# Altium schematic sheet [0X] - CPU.SchDoc
size A2; DocumentNumber: 2; SheetNumber: 2; SheetTotal: 4
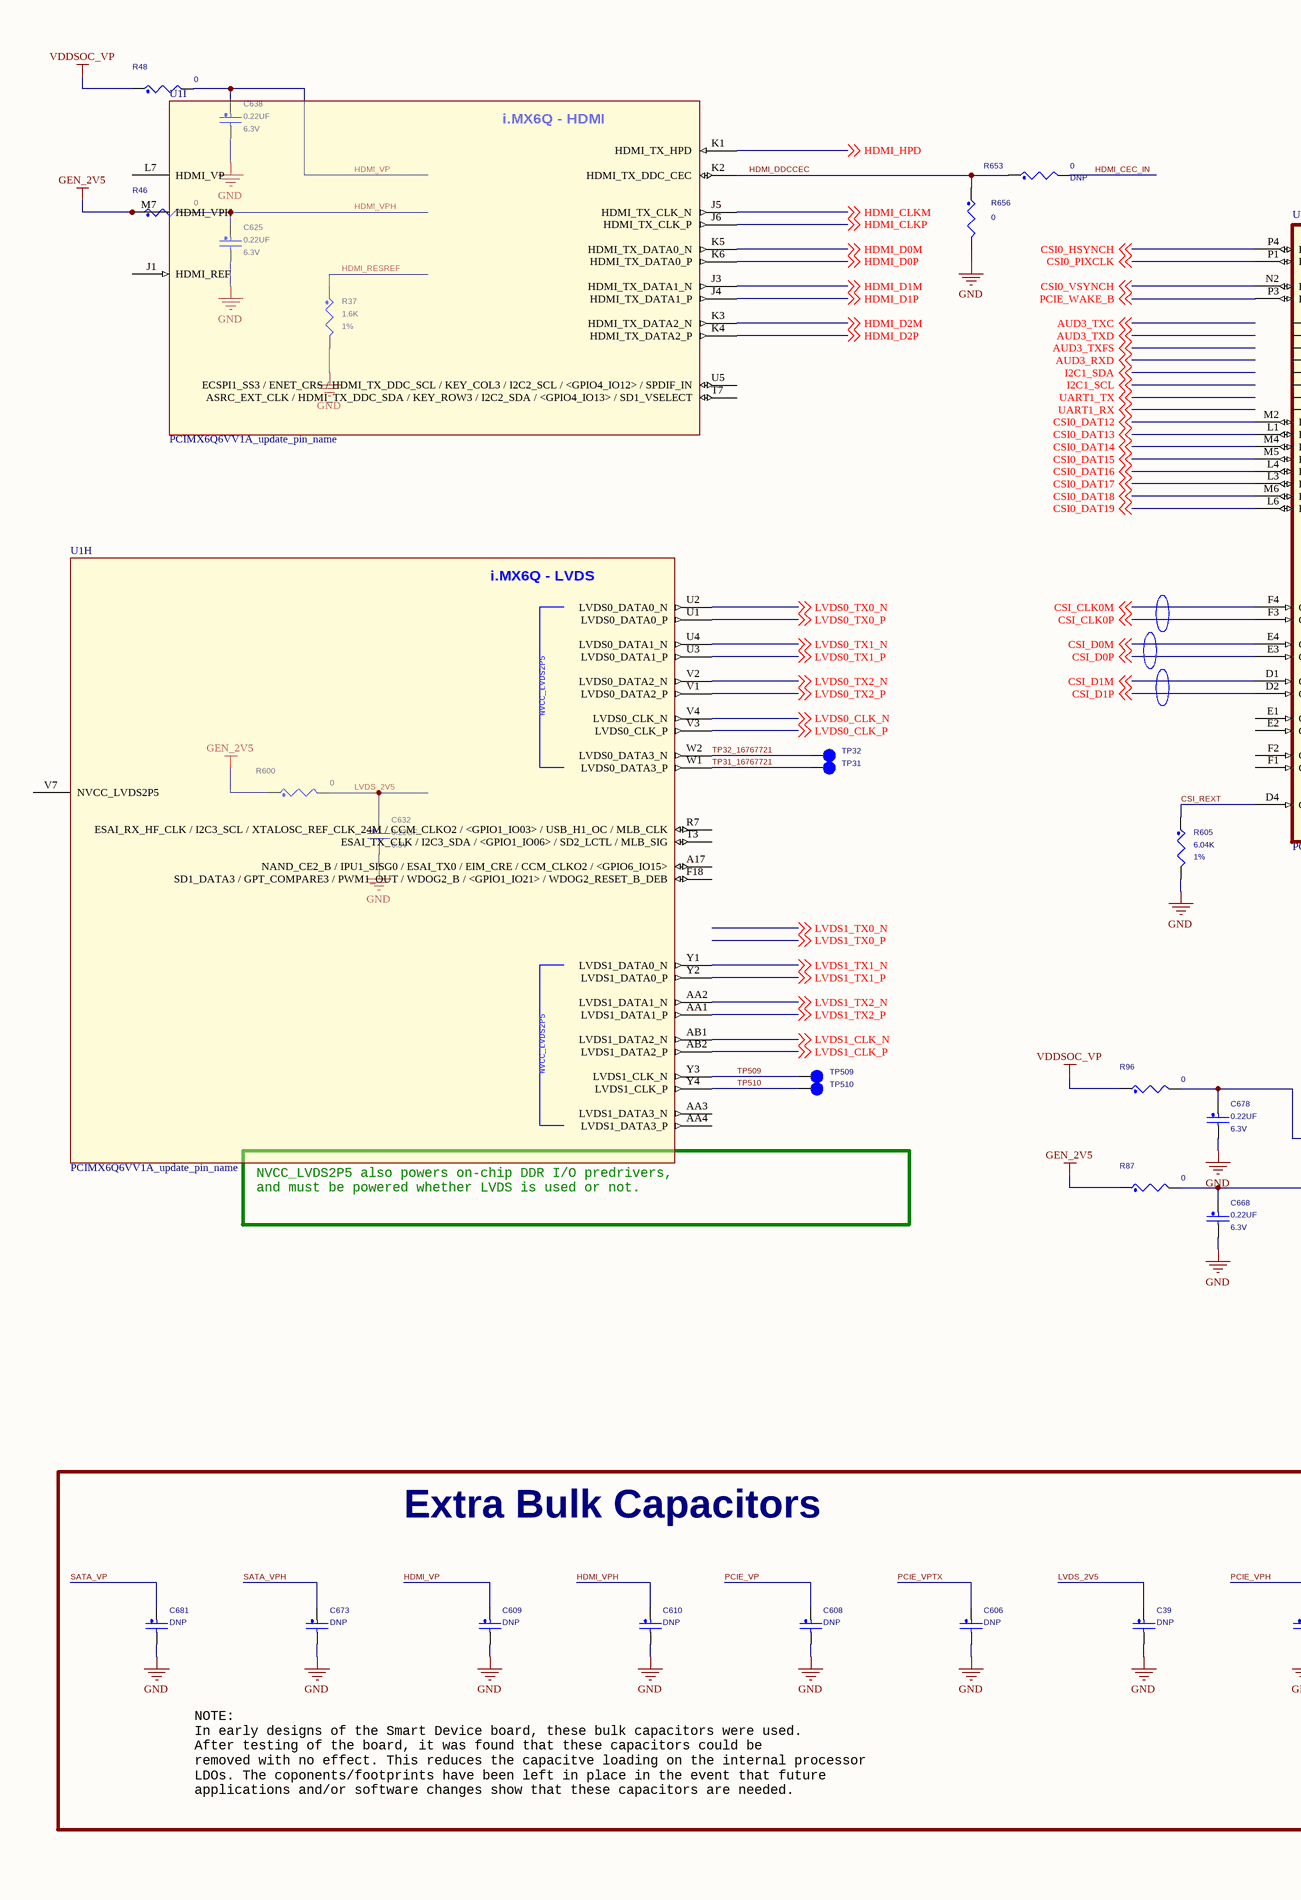
[diagram p0: [0X] - CPU.SchDoc, left]
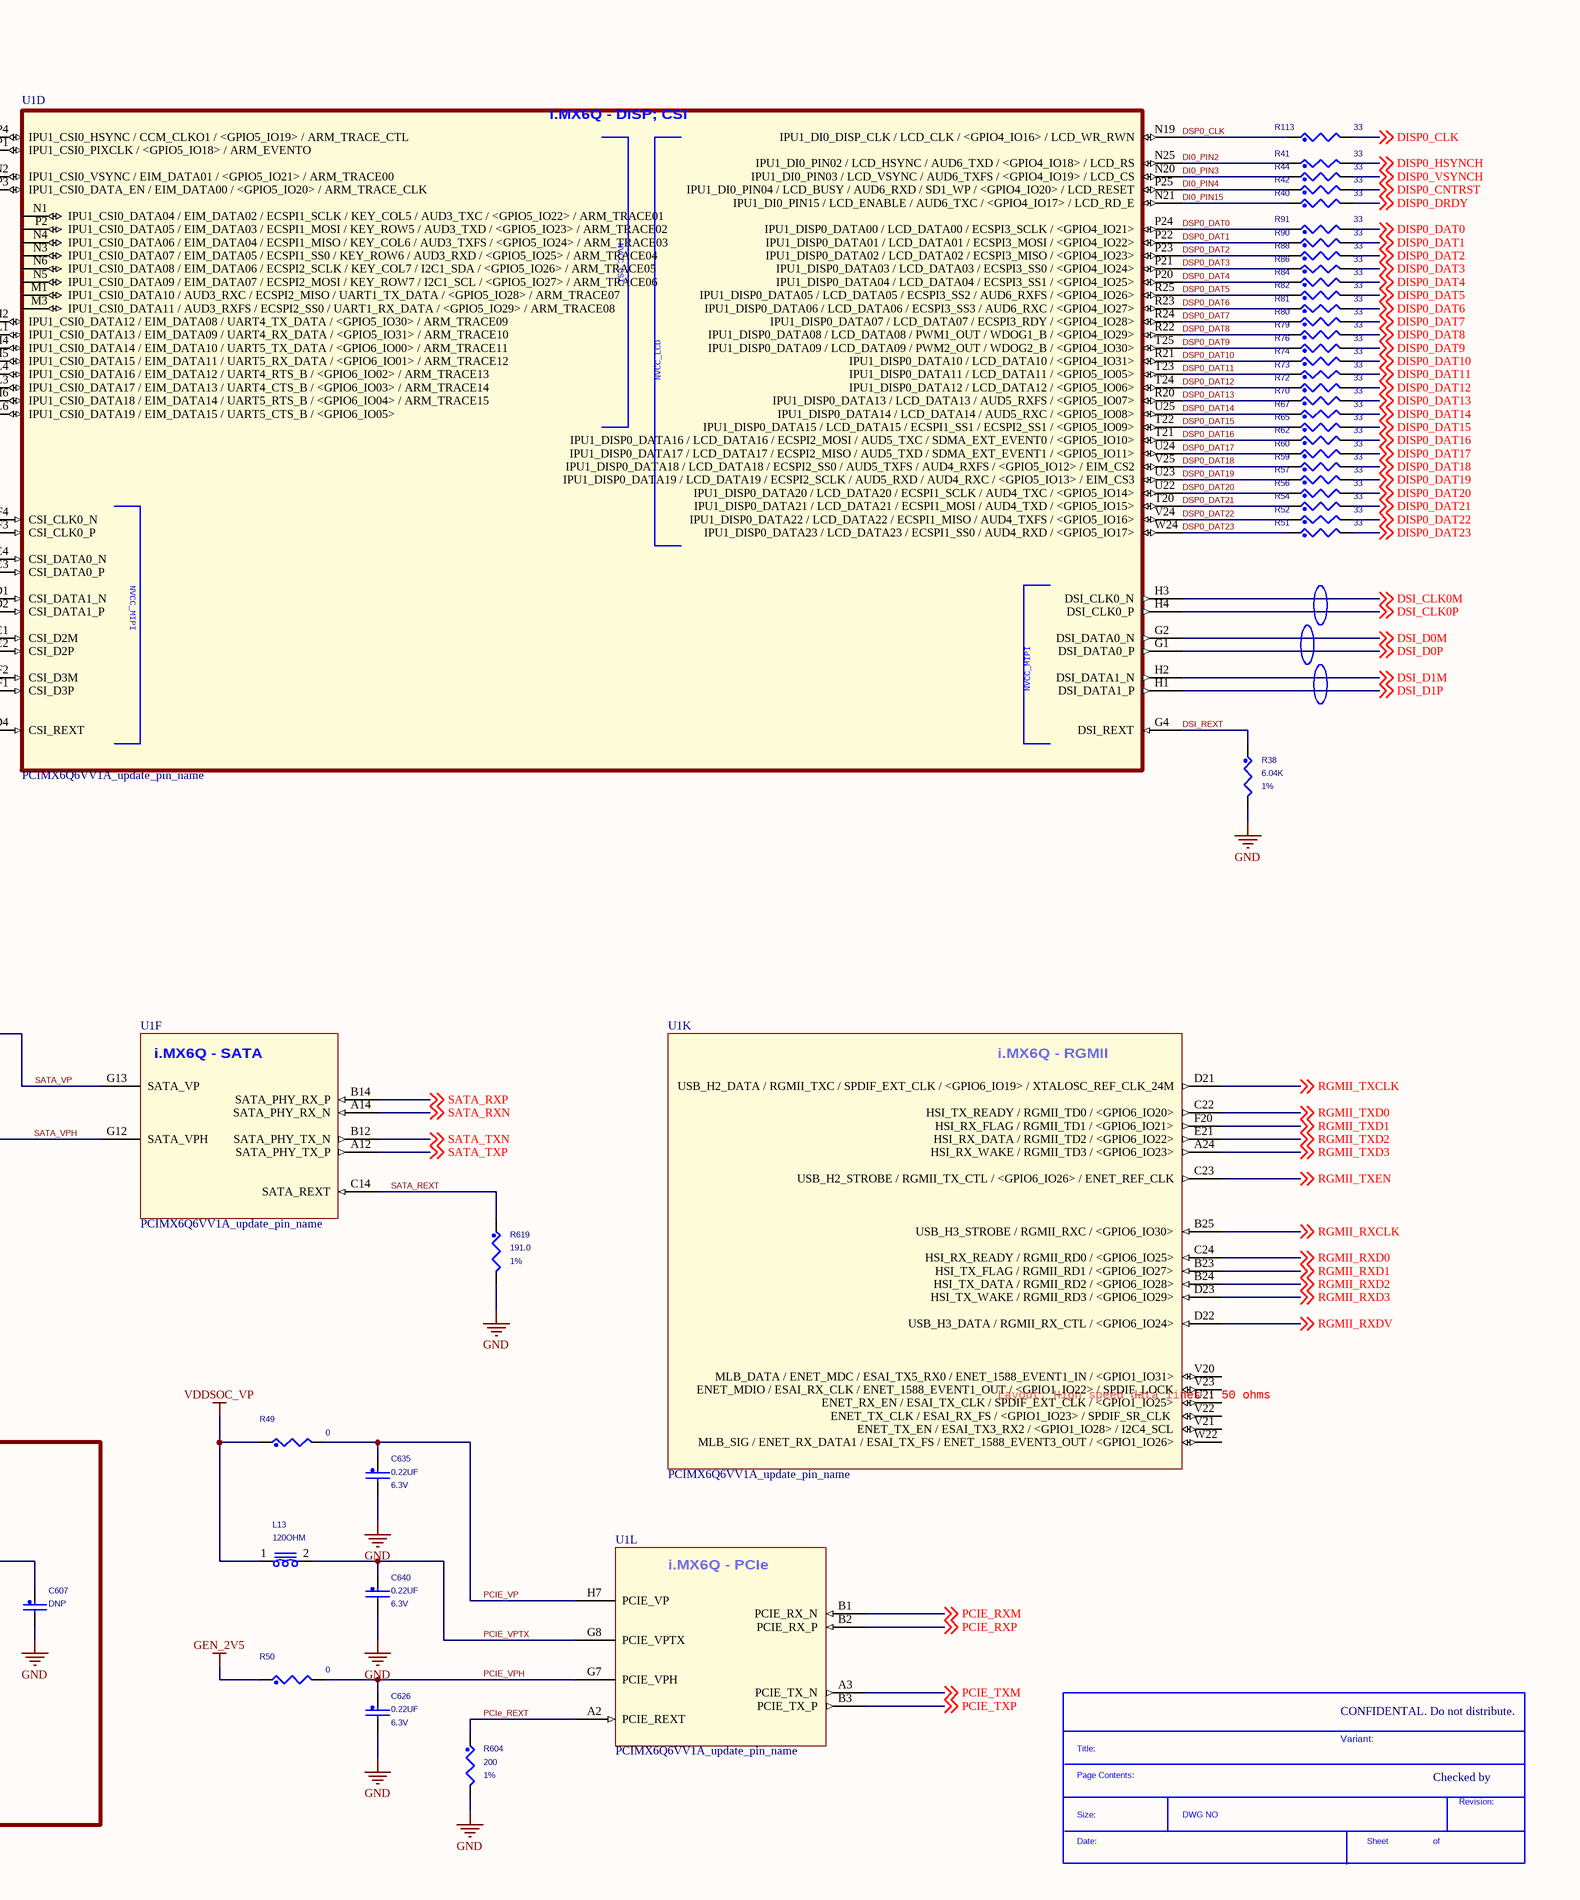
[diagram p1: [0X] - CPU.SchDoc, right]

## Parts
*  SDTitleBlock  (value not drawn)  (graphical)
C39  ASSY_OPT: DNP  [0603_CC]  (hidden comment: 4.7UF)
C606  ASSY_OPT: DNP  [0603_CC]  (hidden comment: 4.7UF)
C607  ASSY_OPT: DNP  [0603_CC]  (hidden comment: 4.7UF)
C608  ASSY_OPT: DNP  [0603_CC]  (hidden comment: 4.7UF)
C609  ASSY_OPT: DNP  [0603_CC]  (hidden comment: 4.7UF)
C610  ASSY_OPT: DNP  [0603_CC]  (hidden comment: 4.7UF)
C625  0.22UF  WVDC: 6.3V  [0201_CC]
C626  0.22UF  WVDC: 6.3V  [0201_CC]
C632  0.22UF  WVDC: 6.3V  [0201_CC]
C635  0.22UF  WVDC: 6.3V  [0201_CC]
C638  0.22UF  WVDC: 6.3V  [0201_CC]
C640  0.22UF  WVDC: 6.3V  [0201_CC]
C668  0.22UF  WVDC: 6.3V  [0201_CC]
C673  ASSY_OPT: DNP  [0603_CC]  (hidden comment: 4.7UF)
C678  0.22UF  WVDC: 6.3V  [0201_CC]
C681  ASSY_OPT: DNP  [0603_CC]  (hidden comment: 4.7UF)
L13  120OHM  [0603_CC]
R37  1.6K  Tolerance: 1%  [0402_CC]
R38  6.04K  Tolerance: 1%  [0402_CC]
R40  33  [0402_CC]
R41  33  [0402_CC]
R42  33  [0402_CC]
R44  33  [0402_CC]
R46  0  [0402_CC]
R48  0  [0402_CC]
R49  0  [0402_CC]
R50  0  [0402_CC]
R51  33  [0402_CC]
R52  33  [0402_CC]
R54  33  [0402_CC]
R56  33  [0402_CC]
R57  33  [0402_CC]
R59  33  [0402_CC]
R60  33  [0402_CC]
R62  33  [0402_CC]
R65  33  [0402_CC]
R67  33  [0402_CC]
R70  33  [0402_CC]
R72  33  [0402_CC]
R73  33  [0402_CC]
R74  33  [0402_CC]
R76  33  [0402_CC]
R79  33  [0402_CC]
R80  33  [0402_CC]
R81  33  [0402_CC]
R82  33  [0402_CC]
R84  33  [0402_CC]
R86  33  [0402_CC]
R87  0  [0402_CC]
R88  33  [0402_CC]
R90  33  [0402_CC]
R91  33  [0402_CC]
R96  0  [0402_CC]
R113  33  [0402_CC]
R600  0  [0402_CC]
R604  200  Tolerance: 1%  [0402_CC]
R605  6.04K  Tolerance: 1%  [0402_CC]
R619  191.0  Tolerance: 1%  [0603_CC]
R653  0  ASSY_OPT: DNP  [0402_CC]
R656  0  [0402_CC]
TP31  tpad_020  [tpad_020]  (value not drawn)
TP32  tpad_020  [tpad_020]  (value not drawn)
TP509  tpad_020  [tpad_020]  (value not drawn)
TP510  tpad_020  [tpad_020]  (value not drawn)
U1  PCIMX6Q6VV1A_update_pin_name  (parts D,F,H,I,K,L of 17)

## Blocks framed on the sheet
Extra Bulk Capacitors: C39 C606-C610 C673 C681

## Nets
GEN_2V5: R46.1 R50.1 R87.1 R600.1 U1.M7(HDMI_VPH)
GND: C39.2 C606.2 C607.2 C608.2 C609.2 C610.2 C625.2 C626.2 C632.2 C635.2 C638.2 C640.2 C668.2 C673.2 C678.2 C681.2 R37.2 R38.2 R604.2 R605.2 R619.2 R656.2
VDDSOC_VP: L13.1 R48.1 R49.1 R96.1
CSI0_DAT12: U1.M2(IPU1_CSI0_DATA12_/_EIM_DATA08_/_UART4_TX_DATA_/_<GPIO5_IO30>_/_ARM_TRACE09) ; off-sheet CSI0_DAT12
CSI0_DAT13: U1.L1(IPU1_CSI0_DATA13_/_EIM_DATA09_/_UART4_RX_DATA_/_<GPIO5_IO31>_/_ARM_TRACE10) ; off-sheet CSI0_DAT13
CSI0_DAT14: U1.M4(IPU1_CSI0_DATA14_/_EIM_DATA10_/_UART5_TX_DATA_/_<GPIO6_IO00>_/_ARM_TRACE11) ; off-sheet CSI0_DAT14
CSI0_DAT15: U1.M5(IPU1_CSI0_DATA15_/_EIM_DATA11_/_UART5_RX_DATA_/_<GPIO6_IO01>_/_ARM_TRACE12) ; off-sheet CSI0_DAT15
CSI0_DAT16: U1.L4(IPU1_CSI0_DATA16_/_EIM_DATA12_/_UART4_RTS_B_/_<GPIO6_IO02>_/_ARM_TRACE13) ; off-sheet CSI0_DAT16
CSI0_DAT17: U1.L3(IPU1_CSI0_DATA17_/_EIM_DATA13_/_UART4_CTS_B_/_<GPIO6_IO03>_/_ARM_TRACE14) ; off-sheet CSI0_DAT17
CSI0_DAT18: U1.M6(IPU1_CSI0_DATA18_/_EIM_DATA14_/_UART5_RTS_B_/_<GPIO6_IO04>_/_ARM_TRACE15) ; off-sheet CSI0_DAT18
CSI0_DAT19: U1.L6(IPU1_CSI0_DATA19_/_EIM_DATA15_/_UART5_CTS_B_/_<GPIO6_IO05>) ; off-sheet CSI0_DAT19
CSI0_HSYNCH: U1.P4(IPU1_CSI0_HSYNC_/_CCM_CLKO1_/_<GPIO5_IO19>_/_ARM_TRACE_CTL) ; off-sheet CSI0_HSYNCH
CSI0_PIXCLK: U1.P1(IPU1_CSI0_PIXCLK_/_<GPIO5_IO18>_/_ARM_EVENTO) ; off-sheet CSI0_PIXCLK
CSI0_VSYNCH: U1.N2(IPU1_CSI0_VSYNC_/_EIM_DATA01_/_<GPIO5_IO21>_/_ARM_TRACE00) ; off-sheet CSI0_VSYNCH
CSI_CLK0M: U1.F4(CSI_CLK0_N) ; off-sheet CSI_CLK0M
CSI_CLK0P: U1.F3(CSI_CLK0_P) ; off-sheet CSI_CLK0P
CSI_D0M: U1.E4(CSI_DATA0_N) ; off-sheet CSI_D0M
CSI_D0P: U1.E3(CSI_DATA0_P) ; off-sheet CSI_D0P
CSI_D1M: U1.D1(CSI_DATA1_N) ; off-sheet CSI_D1M
CSI_D1P: U1.D2(CSI_DATA1_P) ; off-sheet CSI_D1P
CSI_REXT: R605.1 U1.D4(CSI_REXT)
DI0_PIN2: R41.1 U1.N25(IPU1_DI0_PIN02_/_LCD_HSYNC_/_AUD6_TXD_/_<GPIO4_IO18>_/_LCD_RS)
DI0_PIN3: R44.1 U1.N20(IPU1_DI0_PIN03_/_LCD_VSYNC_/_AUD6_TXFS_/_<GPIO4_IO19>_/_LCD_CS)
DI0_PIN4: R42.1 U1.P25(IPU1_DI0_PIN04_/_LCD_BUSY_/_AUD6_RXD_/_SD1_WP_/_<GPIO4_IO20>_/_LCD_RESET)
DI0_PIN15: R40.1 U1.N21(IPU1_DI0_PIN15_/_LCD_ENABLE_/_AUD6_TXC_/_<GPIO4_IO17>_/_LCD_RD_E)
DISP0_CLK: R113.2 ; off-sheet DISP0_CLK
DISP0_CNTRST: R42.2 ; off-sheet DISP0_CNTRST
DISP0_DAT0: R91.2 ; off-sheet DISP0_DAT0
DISP0_DAT1: R90.2 ; off-sheet DISP0_DAT1
DISP0_DAT2: R88.2 ; off-sheet DISP0_DAT2
DISP0_DAT3: R86.2 ; off-sheet DISP0_DAT3
DISP0_DAT4: R84.2 ; off-sheet DISP0_DAT4
DISP0_DAT5: R82.2 ; off-sheet DISP0_DAT5
DISP0_DAT6: R81.2 ; off-sheet DISP0_DAT6
DISP0_DAT7: R80.2 ; off-sheet DISP0_DAT7
DISP0_DAT8: R79.2 ; off-sheet DISP0_DAT8
DISP0_DAT9: R76.2 ; off-sheet DISP0_DAT9
DISP0_DAT10: R74.2 ; off-sheet DISP0_DAT10
DISP0_DAT11: R73.2 ; off-sheet DISP0_DAT11
DISP0_DAT12: R72.2 ; off-sheet DISP0_DAT12
DISP0_DAT13: R70.2 ; off-sheet DISP0_DAT13
DISP0_DAT14: R67.2 ; off-sheet DISP0_DAT14
DISP0_DAT15: R65.2 ; off-sheet DISP0_DAT15
DISP0_DAT16: R62.2 ; off-sheet DISP0_DAT16
DISP0_DAT17: R60.2 ; off-sheet DISP0_DAT17
DISP0_DAT18: R59.2 ; off-sheet DISP0_DAT18
DISP0_DAT19: R57.2 ; off-sheet DISP0_DAT19
DISP0_DAT20: R56.2 ; off-sheet DISP0_DAT20
DISP0_DAT21: R54.2 ; off-sheet DISP0_DAT21
DISP0_DAT22: R52.2 ; off-sheet DISP0_DAT22
DISP0_DAT23: R51.2 ; off-sheet DISP0_DAT23
DISP0_DRDY: R40.2 ; off-sheet DISP0_DRDY
DISP0_HSYNCH: R41.2 ; off-sheet DISP0_HSYNCH
DISP0_VSYNCH: R44.2 ; off-sheet DISP0_VSYNCH
DSI_CLK0M: U1.H3(DSI_CLK0_N) ; off-sheet DSI_CLK0M
DSI_CLK0P: U1.H4(DSI_CLK0_P) ; off-sheet DSI_CLK0P
DSI_D0M: U1.G2(DSI_DATA0_N) ; off-sheet DSI_D0M
DSI_D0P: U1.G1(DSI_DATA0_P) ; off-sheet DSI_D0P
DSI_D1M: U1.H2(DSI_DATA1_N) ; off-sheet DSI_D1M
DSI_D1P: U1.H1(DSI_DATA1_P) ; off-sheet DSI_D1P
DSI_REXT: R38.1 U1.G4(DSI_REXT)
DSP0_CLK: R113.1 U1.N19(IPU1_DI0_DISP_CLK_/_LCD_CLK_/_<GPIO4_IO16>_/_LCD_WR_RWN)
DSP0_DAT0: R91.1 U1.P24(IPU1_DISP0_DATA00_/_LCD_DATA00_/_ECSPI3_SCLK_/_<GPIO4_IO21>)
DSP0_DAT1: R90.1 U1.P22(IPU1_DISP0_DATA01_/_LCD_DATA01_/_ECSPI3_MOSI_/_<GPIO4_IO22>)
DSP0_DAT2: R88.1 U1.P23(IPU1_DISP0_DATA02_/_LCD_DATA02_/_ECSPI3_MISO_/_<GPIO4_IO23>)
DSP0_DAT3: R86.1 U1.P21(IPU1_DISP0_DATA03_/_LCD_DATA03_/_ECSPI3_SS0_/_<GPIO4_IO24>)
DSP0_DAT4: R84.1 U1.P20(IPU1_DISP0_DATA04_/_LCD_DATA04_/_ECSPI3_SS1_/_<GPIO4_IO25>)
DSP0_DAT5: R82.1 U1.R25(IPU1_DISP0_DATA05_/_LCD_DATA05_/_ECSPI3_SS2_/_AUD6_RXFS_/_<GPIO4_IO26>)
DSP0_DAT6: R81.1 U1.R23(IPU1_DISP0_DATA06_/_LCD_DATA06_/_ECSPI3_SS3_/_AUD6_RXC_/_<GPIO4_IO27>)
DSP0_DAT7: R80.1 U1.R24(IPU1_DISP0_DATA07_/_LCD_DATA07_/_ECSPI3_RDY_/_<GPIO4_IO28>)
DSP0_DAT8: R79.1 U1.R22(IPU1_DISP0_DATA08_/_LCD_DATA08_/_PWM1_OUT_/_WDOG1_B_/_<GPIO4_IO29>)
DSP0_DAT9: R76.1 U1.T25(IPU1_DISP0_DATA09_/_LCD_DATA09_/_PWM2_OUT_/_WDOG2_B_/_<GPIO4_IO30>)
DSP0_DAT10: R74.1 U1.R21(IPU1_DISP0_DATA10_/_LCD_DATA10_/_<GPIO4_IO31>)
DSP0_DAT11: R73.1 U1.T23(IPU1_DISP0_DATA11_/_LCD_DATA11_/_<GPIO5_IO05>)
DSP0_DAT12: R72.1 U1.T24(IPU1_DISP0_DATA12_/_LCD_DATA12_/_<GPIO5_IO06>)
DSP0_DAT13: R70.1 U1.R20(IPU1_DISP0_DATA13_/_LCD_DATA13_/_AUD5_RXFS_/_<GPIO5_IO07>)
DSP0_DAT14: R67.1 U1.U25(IPU1_DISP0_DATA14_/_LCD_DATA14_/_AUD5_RXC_/_<GPIO5_IO08>)
DSP0_DAT15: R65.1 U1.T22(IPU1_DISP0_DATA15_/_LCD_DATA15_/_ECSPI1_SS1_/_ECSPI2_SS1_/_<GPIO5_IO09>)
DSP0_DAT16: R62.1 U1.T21(IPU1_DISP0_DATA16_/_LCD_DATA16_/_ECSPI2_MOSI_/_AUD5_TXC_/_SDMA_EXT_EVENT0_/_<GPIO5_IO10>)
DSP0_DAT17: R60.1 U1.U24(IPU1_DISP0_DATA17_/_LCD_DATA17_/_ECSPI2_MISO_/_AUD5_TXD_/_SDMA_EXT_EVENT1_/_<GPIO5_IO11>)
DSP0_DAT18: R59.1 U1.V25(IPU1_DISP0_DATA18_/_LCD_DATA18_/_ECSPI2_SS0_/_AUD5_TXFS_/_AUD4_RXFS_/_<GPIO5_IO12>_/_EIM_CS2)
DSP0_DAT19: R57.1 U1.U23(IPU1_DISP0_DATA19_/_LCD_DATA19_/_ECSPI2_SCLK_/_AUD5_RXD_/_AUD4_RXC_/_<GPIO5_IO13>_/_EIM_CS3)
DSP0_DAT20: R56.1 U1.U22(IPU1_DISP0_DATA20_/_LCD_DATA20_/_ECSPI1_SCLK_/_AUD4_TXC_/_<GPIO5_IO14>)
DSP0_DAT21: R54.1 U1.T20(IPU1_DISP0_DATA21_/_LCD_DATA21_/_ECSPI1_MOSI_/_AUD4_TXD_/_<GPIO5_IO15>)
DSP0_DAT22: R52.1 U1.V24(IPU1_DISP0_DATA22_/_LCD_DATA22_/_ECSPI1_MISO_/_AUD4_TXFS_/_<GPIO5_IO16>)
DSP0_DAT23: R51.1 U1.W24(IPU1_DISP0_DATA23_/_LCD_DATA23_/_ECSPI1_SS0_/_AUD4_RXD_/_<GPIO5_IO17>)
HDMI_CEC_IN: R653.2
HDMI_CLKM: U1.J5(HDMI_TX_CLK_N) ; off-sheet HDMI_CLKM
HDMI_CLKP: U1.J6(HDMI_TX_CLK_P) ; off-sheet HDMI_CLKP
HDMI_D0M: U1.K5(HDMI_TX_DATA0_N) ; off-sheet HDMI_D0M
HDMI_D0P: U1.K6(HDMI_TX_DATA0_P) ; off-sheet HDMI_D0P
HDMI_D1M: U1.J3(HDMI_TX_DATA1_N) ; off-sheet HDMI_D1M
HDMI_D1P: U1.J4(HDMI_TX_DATA1_P) ; off-sheet HDMI_D1P
HDMI_D2M: U1.K3(HDMI_TX_DATA2_N) ; off-sheet HDMI_D2M
HDMI_D2P: U1.K4(HDMI_TX_DATA2_P) ; off-sheet HDMI_D2P
HDMI_DDCCEC: R653.1 R656.1 U1.K2(HDMI_TX_DDC_CEC)
HDMI_HPD: U1.K1(HDMI_TX_HPD) ; off-sheet HDMI_HPD
HDMI_RESREF: R37.1
HDMI_VP: C609.1 C638.1 R48.2
HDMI_VPH: C610.1 C625.1 R46.2
LVDS0_CLK_N: U1.V4(LVDS0_CLK_N) ; off-sheet LVDS0_CLK_N
LVDS0_CLK_P: U1.V3(LVDS0_CLK_P) ; off-sheet LVDS0_CLK_P
LVDS0_TX0_N: U1.U2(LVDS0_DATA0_N) ; off-sheet LVDS0_TX0_N
LVDS0_TX0_P: U1.U1(LVDS0_DATA0_P) ; off-sheet LVDS0_TX0_P
LVDS0_TX1_N: U1.U4(LVDS0_DATA1_N) ; off-sheet LVDS0_TX1_N
LVDS0_TX1_P: U1.U3(LVDS0_DATA1_P) ; off-sheet LVDS0_TX1_P
LVDS0_TX2_N: U1.V2(LVDS0_DATA2_N) ; off-sheet LVDS0_TX2_N
LVDS0_TX2_P: U1.V1(LVDS0_DATA2_P) ; off-sheet LVDS0_TX2_P
LVDS1_CLK_N: U1.AB1(LVDS1_DATA2_N) ; off-sheet LVDS1_CLK_N
LVDS1_CLK_P: U1.AB2(LVDS1_DATA2_P) ; off-sheet LVDS1_CLK_P
LVDS1_TX1_N: U1.Y1(LVDS1_DATA0_N) ; off-sheet LVDS1_TX1_N
LVDS1_TX1_P: U1.Y2(LVDS1_DATA0_P) ; off-sheet LVDS1_TX1_P
LVDS1_TX2_N: U1.AA2(LVDS1_DATA1_N) ; off-sheet LVDS1_TX2_N
LVDS1_TX2_P: U1.AA1(LVDS1_DATA1_P) ; off-sheet LVDS1_TX2_P
LVDS_2V5: C39.1 C632.1 R600.2
PCIe_REXT: R604.1 U1.A2(PCIE_REXT)
PCIE_RXM: U1.B1(PCIE_RX_N) ; off-sheet PCIE_RXM
PCIE_RXP: U1.B2(PCIE_RX_P) ; off-sheet PCIE_RXP
PCIE_TXM: U1.A3(PCIE_TX_N) ; off-sheet PCIE_TXM
PCIE_TXP: U1.B3(PCIE_TX_P) ; off-sheet PCIE_TXP
PCIE_VP: C608.1 C635.1 R49.2 U1.H7(PCIE_VP)
PCIE_VPH: C607.1 C626.1 R50.2 U1.G7(PCIE_VPH)
PCIE_VPTX: C606.1 C640.1 L13.2 U1.G8(PCIE_VPTX)
PCIE_WAKE_B: U1.P3(IPU1_CSI0_DATA_EN_/_EIM_DATA00_/_<GPIO5_IO20>_/_ARM_TRACE_CLK) ; off-sheet PCIE_WAKE_B
RGMII_RXCLK: U1.B25(USB_H3_STROBE_/_RGMII_RXC_/_<GPIO6_IO30>) ; off-sheet RGMII_RXCLK
RGMII_RXD0: U1.C24(HSI_RX_READY_/_RGMII_RD0_/_<GPIO6_IO25>) ; off-sheet RGMII_RXD0
RGMII_RXD1: U1.B23(HSI_TX_FLAG_/_RGMII_RD1_/_<GPIO6_IO27>) ; off-sheet RGMII_RXD1
RGMII_RXD2: U1.B24(HSI_TX_DATA_/_RGMII_RD2_/_<GPIO6_IO28>) ; off-sheet RGMII_RXD2
RGMII_RXD3: U1.D23(HSI_TX_WAKE_/_RGMII_RD3_/_<GPIO6_IO29>) ; off-sheet RGMII_RXD3
RGMII_RXDV: U1.D22(USB_H3_DATA_/_RGMII_RX_CTL_/_<GPIO6_IO24>) ; off-sheet RGMII_RXDV
RGMII_TXCLK: U1.D21(USB_H2_DATA_/_RGMII_TXC_/_SPDIF_EXT_CLK_/_<GPIO6_IO19>_/_XTALOSC_REF_CLK_24M) ; off-sheet RGMII_TXCLK
RGMII_TXD0: U1.C22(HSI_TX_READY_/_RGMII_TD0_/_<GPIO6_IO20>) ; off-sheet RGMII_TXD0
RGMII_TXD1: U1.F20(HSI_RX_FLAG_/_RGMII_TD1_/_<GPIO6_IO21>) ; off-sheet RGMII_TXD1
RGMII_TXD2: U1.E21(HSI_RX_DATA_/_RGMII_TD2_/_<GPIO6_IO22>) ; off-sheet RGMII_TXD2
RGMII_TXD3: U1.A24(HSI_RX_WAKE_/_RGMII_TD3_/_<GPIO6_IO23>) ; off-sheet RGMII_TXD3
RGMII_TXEN: U1.C23(USB_H2_STROBE_/_RGMII_TX_CTL_/_<GPIO6_IO26>_/_ENET_REF_CLK) ; off-sheet RGMII_TXEN
SATA_REXT: R619.1 U1.C14(SATA_REXT)
SATA_RXN: U1.A14(SATA_PHY_RX_N) ; off-sheet SATA_RXN
SATA_RXP: U1.B14(SATA_PHY_RX_P) ; off-sheet SATA_RXP
SATA_TXN: U1.B12(SATA_PHY_TX_N) ; off-sheet SATA_TXN
SATA_TXP: U1.A12(SATA_PHY_TX_P) ; off-sheet SATA_TXP
SATA_VP: C678.1 C681.1 R96.2 U1.G13(SATA_VP)
SATA_VPH: C668.1 C673.1 R87.2 U1.G12(SATA_VPH)
TP31_16767721: TP31.1(Pin1) U1.W1(LVDS0_DATA3_P)
TP32_16767721: TP32.1(Pin1) U1.W2(LVDS0_DATA3_N)
TP509: TP509.1(Pin1) U1.Y3(LVDS1_CLK_N)
TP510: TP510.1(Pin1) U1.Y4(LVDS1_CLK_P)

Not connected (* = marked no-connect by the designer): U1 A17(NAND_CE2_B_/_IPU1_SISG0_/_ESAI_TX0_/_EIM_CRE_/_CCM_CLKO2_/_<GPIO6_IO15>) AA3(LVDS1_DATA3_N) AA4(LVDS1_DATA3_P) E1(CSI_D2M) E2(CSI_D2P) F1(CSI_D3P) F2(CSI_D3M) F18(SD1_DATA3_/_GPT_COMPARE3_/_PWM1_OUT_/_WDOG2_B_/_<GPIO1_IO21>_/_WDOG2_RESET_B_DEB) J1(HDMI_REF) L7(HDMI_VP) M1(IPU1_CSI0_DATA10_/_AUD3_RXC_/_ECSPI2_MISO_/_UART1_TX_DATA_/_<GPIO5_IO28>_/_ARM_TRACE07) M3(IPU1_CSI0_DATA11_/_AUD3_RXFS_/_ECSPI2_SS0_/_UART1_RX_DATA_/_<GPIO5_IO29>_/_ARM_TRACE08) N1(IPU1_CSI0_DATA04_/_EIM_DATA02_/_ECSPI1_SCLK_/_KEY_COL5_/_AUD3_TXC_/_<GPIO5_IO22>_/_ARM_TRACE01) N3(IPU1_CSI0_DATA07_/_EIM_DATA05_/_ECSPI1_SS0_/_KEY_ROW6_/_AUD3_RXD_/_<GPIO5_IO25>_/_ARM_TRACE04) N4(IPU1_CSI0_DATA06_/_EIM_DATA04_/_ECSPI1_MISO_/_KEY_COL6_/_AUD3_TXFS_/_<GPIO5_IO24>_/_ARM_TRACE03) N5(IPU1_CSI0_DATA09_/_EIM_DATA07_/_ECSPI2_MOSI_/_KEY_ROW7_/_I2C1_SCL_/_<GPIO5_IO27>_/_ARM_TRACE06) N6(IPU1_CSI0_DATA08_/_EIM_DATA06_/_ECSPI2_SCLK_/_KEY_COL7_/_I2C1_SDA_/_<GPIO5_IO26>_/_ARM_TRACE05) P2(IPU1_CSI0_DATA05_/_EIM_DATA03_/_ECSPI1_MOSI_/_KEY_ROW5_/_AUD3_TXD_/_<GPIO5_IO23>_/_ARM_TRACE02) R7(ESAI_RX_HF_CLK_/_I2C3_SCL_/_XTALOSC_REF_CLK_24M_/_CCM_CLKO2_/_<GPIO1_IO03>_/_USB_H1_OC_/_MLB_CLK) T3(ESAI_TX_CLK_/_I2C3_SDA_/_<GPIO1_IO06>_/_SD2_LCTL_/_MLB_SIG) T7(ASRC_EXT_CLK_/_HDMI_TX_DDC_SDA_/_KEY_ROW3_/_I2C2_SDA_/_<GPIO4_IO13>_/_SD1_VSELECT) U5(ECSPI1_SS3_/_ENET_CRS_/_HDMI_TX_DDC_SCL_/_KEY_COL3_/_I2C2_SCL_/_<GPIO4_IO12>_/_SPDIF_IN) U21(ENET_RX_EN_/_ESAI_TX_CLK_/_SPDIF_EXT_CLK_/_<GPIO1_IO25>) V7(NVCC_LVDS2P5) V20(MLB_DATA_/_ENET_MDC_/_ESAI_TX5_RX0_/_ENET_1588_EVENT1_IN_/_<GPIO1_IO31>) V21(ENET_TX_EN_/_ESAI_TX3_RX2_/_<GPIO1_IO28>_/_I2C4_SCL) V22(ENET_TX_CLK_/_ESAI_RX_FS_/_<GPIO1_IO23>_/_SPDIF_SR_CLK_) V23(ENET_MDIO_/_ESAI_RX_CLK_/_ENET_1588_EVENT1_OUT_/_<GPIO1_IO22>_/_SPDIF_LOCK) W22(MLB_SIG_/_ENET_RX_DATA1_/_ESAI_TX_FS_/_ENET_1588_EVENT3_OUT_/_<GPIO1_IO26>)

## Notes on the sheet
- (near U1) NVCC_LVDS2P5 also powers on-chip DDR I/O predrivers,
  and must be powered whether LVDS is used or not.
- (near U1) Layout: High speed data lines : 50 ohms
- CONFIDENTAL. Do not distribute.
- CLOCKS (CPU & PCIE)
- Variant:
- Checked by
- NOTE:
  In early designs of the Smart Device board, these bulk capacitors were used.
  After testing of the board, it was found that these capacitors could be
  removed with no effect. This reduces the capacitve loading on the internal processor
  LDOs. The coponents/footprints have been left in place in the event that future
  applications and/or software changes show that these capacitors are needed.
- (in symbol PCIMX6Q6VV1A_update_pin_name, part D) i.MX6Q - DISP; CSI
- (in symbol PCIMX6Q6VV1A_update_pin_name, part F) i.MX6Q - SATA
- (in symbol PCIMX6Q6VV1A_update_pin_name, part H) i.MX6Q - LVDS
- (in symbol PCIMX6Q6VV1A_update_pin_name, part I) i.MX6Q - HDMI
- (in symbol PCIMX6Q6VV1A_update_pin_name, part K) i.MX6Q - RGMII
- (in symbol PCIMX6Q6VV1A_update_pin_name, part L) i.MX6Q - PCIe
- (in symbol SDTitleBlock) Title:; Page Contents:; Revision:; Size:; DWG NO; Date:; Sheet; of

## Library data of the parts
C39 = CAP_NP: CAP CER 4.7UF 10V 10% X5R 0603; CLASS: DISCRETE; SIGNAL_MODEL: DEFAULT_CAPACITOR_4.7e+06pF_2_1; WVDC: 6.3V; AGILE_PN: 150-77975; MFG_NAME01: TAIYO YUDEN; MFG_PN01: LMK107BJ475KA-T; CAD_APPROVED: Yes; FPLIST: CC0603_OV,CC0603,0603_CC; Tolerance: 10%; ROHS: Yes; HEIGHT: 0.9MM; VOLTAGE: 10V
C606-C608 C673 C681 = CAP_NP: CAP CER 4.7UF 6.3V 10% X5R 0603; CLASS: DISCRETE; ROOM: IMX6X_SOC; AGILE_PN: 150-75487; MFG_NAME01: VENKEL COMPANY; MFG_PN01: C0603X5R6R3-475KNP; CAD_APPROVED: Yes; FPLIST: CC0603_OV,CC0603,0603_CC; PRIORITY_PN: 021-00280; SIGNAL_MODEL: DEFAULT_CAPACITOR_4.7e+06pF_2_1; VOLTAGE: 6.3V; Tolerance: 10%; ROHS: Yes; HEIGHT: 1.016MM; WVDC: 6.3V
C609 = CAP_NP: CAP CER 4.7UF 6.3V 10% X5R 0603; CLASS: DISCRETE; SIGNAL_MODEL: DEFAULT_CAPACITOR_4.7e+06pF_2_1; ROOM: IMX6X_SOC; AGILE_PN: 150-75487; MFG_NAME01: VENKEL COMPANY; MFG_PN01: C0603X5R6R3-475KNP; CAD_APPROVED: Yes; FPLIST: CC0603_OV,CC0603,0603_CC; PRIORITY_PN: 021-00280; WVDC: 6.3V; Tolerance: 10%; ROHS: Yes; HEIGHT: 1.016MM; VOLTAGE: 6.3V
C610 = CAP_NP: CAP CER 4.7UF 6.3V 10% X5R 0603; CLASS: DISCRETE; SIGNAL_MODEL: DEFAULT_CAPACITOR_4.7e+06pF_2_1; PRIORITY_PN: 021-00280; FPLIST: CC0603_OV,CC0603,0603_CC; CAD_APPROVED: Yes; MFG_PN01: C0603X5R6R3-475KNP; MFG_NAME01: VENKEL COMPANY; AGILE_PN: 150-75487; ROOM: IMX6X_SOC; WVDC: 6.3V; HEIGHT: 1.016MM; ROHS: Yes; Tolerance: 10%; VOLTAGE: 6.3V
C625 C668 = CAP_NP: CAP CER 0.22UF 6.3V 20% X5R 0201; CLASS: DISCRETE; PRIORITY_PN: 021-00278; FPLIST: CC0201,CC0201_HD,0201_CC,cc_0201_cir; CAD_APPROVED: Yes; MFG_PN01: JMK063BJ224MP-F; MFG_NAME01: TAIYO YUDEN; AGILE_PN: 150-77852; ROOM: CPU; SIGNAL_MODEL: DEFAULT_CAPACITOR_220000pF_2_1; VOLTAGE: 6.3V; HEIGHT: 0.33 MM; ROHS: Yes; Tolerance: 20%
C626 C640 = CAP_NP: CAP CER 0.22UF 6.3V 20% X5R 0201; CLASS: DISCRETE; SIGNAL_MODEL: DEFAULT_CAPACITOR_220000pF_2_1; ROOM: CPU; AGILE_PN: 150-77852; MFG_NAME01: TAIYO YUDEN; MFG_PN01: JMK063BJ224MP-F; CAD_APPROVED: Yes; FPLIST: CC0201,CC0201_HD,0201_CC,cc_0201_cir; PRIORITY_PN: 021-00278; Tolerance: 20%; ROHS: Yes; HEIGHT: 0.33 MM; VOLTAGE: 6.3V
C632 C638 C678 = CAP_NP: CAP CER 0.22UF 6.3V 20% X5R 0201; CLASS: DISCRETE; ROOM: CPU; AGILE_PN: 150-77852; MFG_NAME01: TAIYO YUDEN; MFG_PN01: JMK063BJ224MP-F; CAD_APPROVED: Yes; FPLIST: CC0201,CC0201_HD,0201_CC,cc_0201_cir; PRIORITY_PN: 021-00278; SIGNAL_MODEL: DEFAULT_CAPACITOR_220000pF_2_1; VOLTAGE: 6.3V; Tolerance: 20%; ROHS: Yes; HEIGHT: 0.33 MM
C635 = CAP_NP: CAP CER 0.22UF 6.3V 20% X5R 0201; CLASS: DISCRETE; SIGNAL_MODEL: DEFAULT_CAPACITOR_220000pF_2_1; PRIORITY_PN: 021-00278; FPLIST: CC0201,CC0201_HD,0201_CC,cc_0201_cir; CAD_APPROVED: Yes; MFG_PN01: JMK063BJ224MP-F; MFG_NAME01: TAIYO YUDEN; AGILE_PN: 150-77852; ROOM: CPU; HEIGHT: 0.33 MM; ROHS: Yes; Tolerance: 20%; VOLTAGE: 6.3V
L13 = BEAD_0: IND FER BEAD 120OHM@100MHZ 2A 25% 0603; PART_TYPE: FERRITE; CLASS: DISCRETE; PRIORITY_PN: 024-00067; MFG_NAME01: MURATA; CAD_APPROVED: Yes; FPLIST: IND_0603,0603_CC; AGILE_PN: 180-30008; MFG_PN01: BLM18PG121SH1; Tolerance: 25%; HEIGHT: 0.95MM; ROHS: Yes
R37 = RES: RES MF 1.6K  1/16W 1% 0402; CLASS: DISCRETE; ROOM: IMX6X_SOC; PRIORITY_PN: 006-01002; FPLIST: RC0402_25,RC0402_HD,0402_CC; CAD_APPROVED: Yes; MFG_PN01: RK73H1ETTP1601F; MFG_NAME01: KOA SPEER; AGILE_PN: 470-30856; SIGNAL_MODEL: DEFAULT_RESISTOR_1600OHM_2_1; ROHS: Yes
R38 = RES: RES MF 6.04K  1/16W 1% 0402; CLASS: DISCRETE; PRIORITY_PN: 006-01007; FPLIST: RC0402_25,RC0402_HD,0402_CC; CAD_APPROVED: Yes; MFG_PN01: RK73H1ETTP6041F; MFG_NAME01: KOA SPEER; AGILE_PN: 470-30923; SIGNAL_MODEL: DEFAULT_RESISTOR_6040OHM_2_1; ROHS: Yes
R40-R42 R44 R59 = RES: RES MF 33 OHM 1/16W 5% 0402; CLASS: DISCRETE; FPLIST: RC0402_25,RC0402_HD,0402_CC; CAD_APPROVED: Yes; MFG_PN01: RC73L2Z330JTF; MFG_NAME01: SMEC; AGILE_PN: 470-75634; SIGNAL_MODEL: DEFAULT_RESISTOR_33OHM_2_1; ROHS: Yes; Tolerance: 5%
R46 R87 R600 = RES: RES MF ZERO OHM 1/10W -- 0402; CLASS: DISCRETE; SIGNAL_MODEL: DEFAULT_RESISTOR_0.001OHM_2_1; AGILE_PN: 470-79965; MFG_NAME01: Panasonic; MFG_PN01: ERJ-2GE0R00X; CAD_APPROVED: Yes; FPLIST: RC0402_25,RC0402_HD,RC0402_X2,0402_CC; ROHS: Yes
R48 R96 = RES: RES MF ZERO OHM 1/10W -- 0402; CLASS: DISCRETE; SIGNAL_MODEL: DEFAULT_RESISTOR_0.001OHM_2_1; FPLIST: RC0402_25,RC0402_HD,RC0402_X2,0402_CC; CAD_APPROVED: Yes; MFG_PN01: ERJ-2GE0R00X; MFG_NAME01: Panasonic; AGILE_PN: 470-79965; ROHS: Yes
R49 = RES: RES MF ZERO OHM 1/10W -- 0402; CLASS: DISCRETE; FPLIST: RC0402_25,RC0402_HD,RC0402_X2,0402_CC; CAD_APPROVED: Yes; MFG_PN01: ERJ-2GE0R00X; MFG_NAME01: Panasonic; AGILE_PN: 470-79965; SIGNAL_MODEL: DEFAULT_RESISTOR_0.001OHM_2_1; ROHS: Yes
R50 R656 = RES: RES MF ZERO OHM 1/10W -- 0402; CLASS: DISCRETE; AGILE_PN: 470-79965; MFG_NAME01: Panasonic; MFG_PN01: ERJ-2GE0R00X; CAD_APPROVED: Yes; FPLIST: RC0402_25,RC0402_HD,RC0402_X2,0402_CC; SIGNAL_MODEL: DEFAULT_RESISTOR_0.001OHM_2_1; ROHS: Yes
R51 R52 R54 R56 R57 R60 R62 R65 R67 R70 R72-R74 R76 R79-R82 R84 R86 R88 R90 R91 R113 = RES: RES MF 33 OHM 1/16W 5% 0402; CLASS: DISCRETE; AGILE_PN: 470-75634; MFG_NAME01: SMEC; MFG_PN01: RC73L2Z330JTF; CAD_APPROVED: Yes; FPLIST: RC0402_25,RC0402_HD,0402_CC; SIGNAL_MODEL: DEFAULT_RESISTOR_33OHM_2_1; Tolerance: 5%; ROHS: Yes
R604 = RES: RES MF 200 OHM 1/16W 1% 0402; CLASS: DISCRETE; SIGNAL_MODEL: DEFAULT_RESISTOR_200OHM_2_1; PRIORITY_PN: 006-00658; FPLIST: RC0402_25,RC0402_HD,0402_CC; CAD_APPROVED: Yes; MFG_PN01: CR02FL6--200R; MFG_NAME01: THYE MING TECH CO LTD; AGILE_PN: 470-76255; ROOM: IMX6X_SOC; ROHS: Yes
R605 = RES: RES MF 6.04K  1/16W 1% 0402; CLASS: DISCRETE; AGILE_PN: 470-30923; MFG_NAME01: KOA SPEER; MFG_PN01: RK73H1ETTP6041F; CAD_APPROVED: Yes; FPLIST: RC0402_25,RC0402_HD,0402_CC; PRIORITY_PN: 006-01007; SIGNAL_MODEL: DEFAULT_RESISTOR_6040OHM_2_1; ROHS: Yes
R619 = RES: RES MF 191.0 OHM  1/10W 1% 0603; CLASS: DISCRETE; FPLIST: RC0603_OV,RC0603,0603_CC; CAD_APPROVED: Yes; MFG_PN01: RK73H1JTTD1910F; MFG_NAME01: KOA SPEER; AGILE_PN: 470-77920; SIGNAL_MODEL: DEFAULT_RESISTOR_191OHM_2_1; ROHS: Yes
R653 = RES: RES MF ZERO OHM 1/10W -- 0402; CLASS: DISCRETE; ROOM: HDMI; PRIORITY_PN: 006-00559; FPLIST: RC0402_25,RC0402_HD,RC0402_X2,0402_CC; CAD_APPROVED: Yes; MFG_PN01: ERJ-2GE0R00X; MFG_NAME01: Panasonic; AGILE_PN: 470-79965; SIGNAL_MODEL: DEFAULT_RESISTOR_0.001OHM_2_1; ROHS: Yes
TP31 TP32 = TESTLOOP: TEST POINT PAD 0.5MM DIA SMT, NO PART TO ORDER; CLASS: IO; CAD_APPROVED: Yes; ASSY_OPT: DNP; AGILE_PN: 211-77484; HEIGHT: 0.1MM; ROHS: Yes
TP509 TP510 = TESTLOOP: TEST POINT PAD 0.5MM DIA SMT, NO PART TO ORDER; CLASS: IO; AGILE_PN: 211-77484; ASSY_OPT: DNP; CAD_APPROVED: Yes; ROHS: Yes; HEIGHT: 0.1MM
U1 = PCIMX6Q6VV1A_update_pin_name: CLASS: IC